# EasyEDA Pro project stm32-motordrive.epro, board PCB3
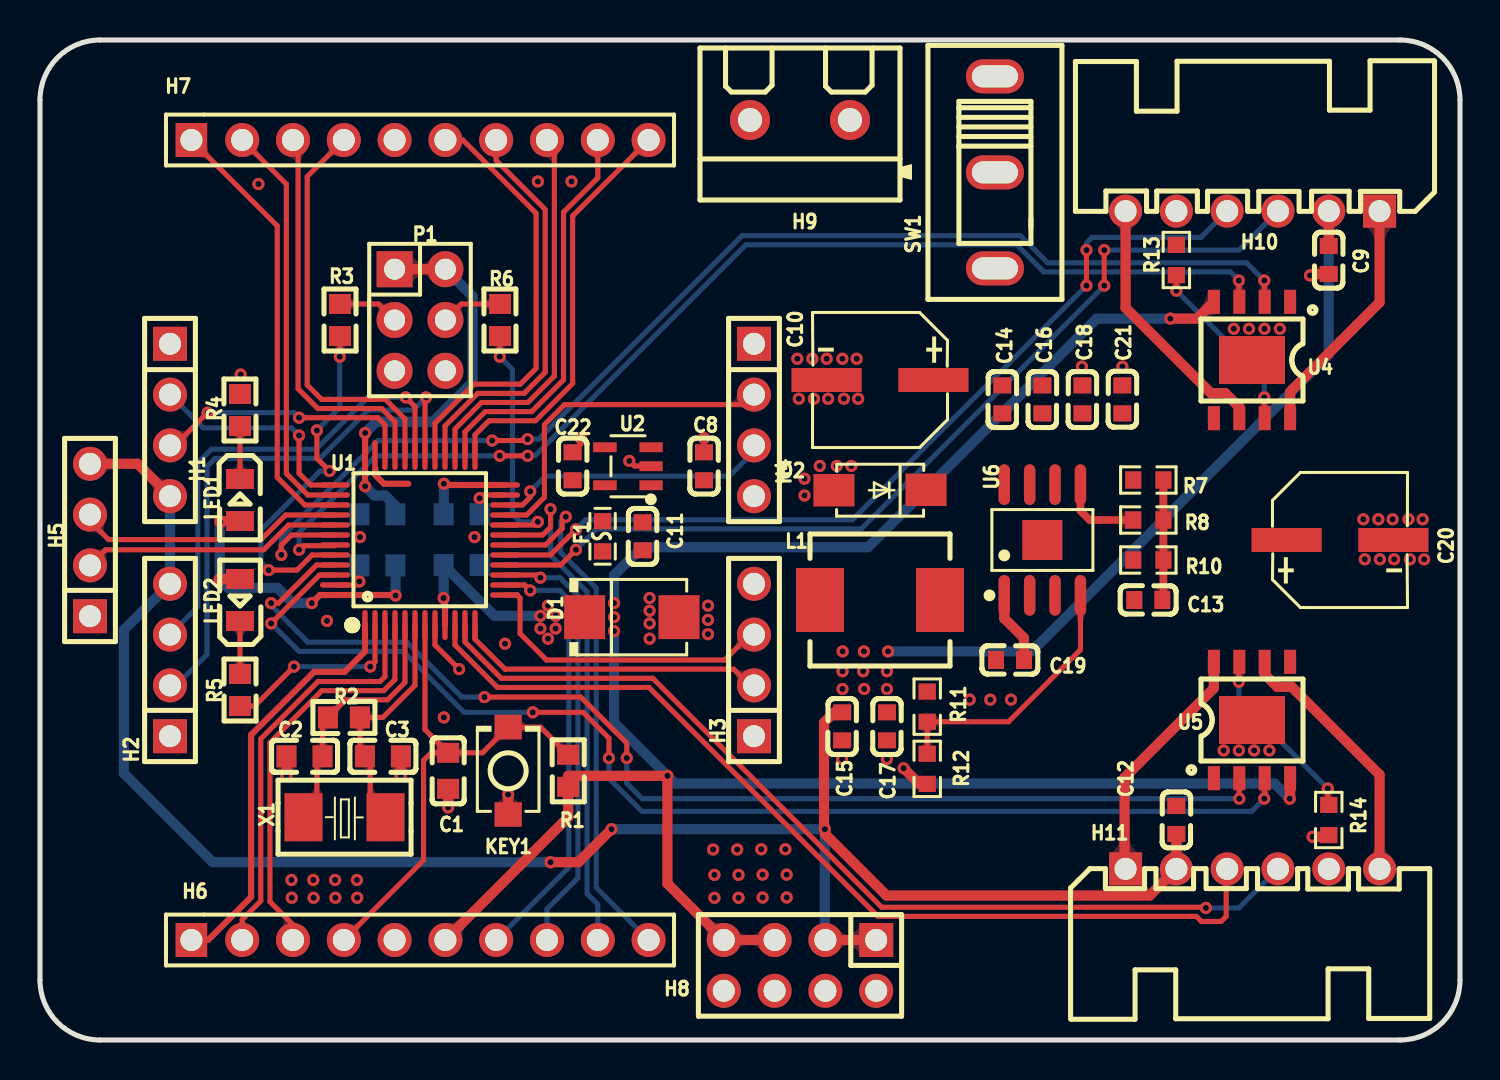
[diagram p9: board, top side]
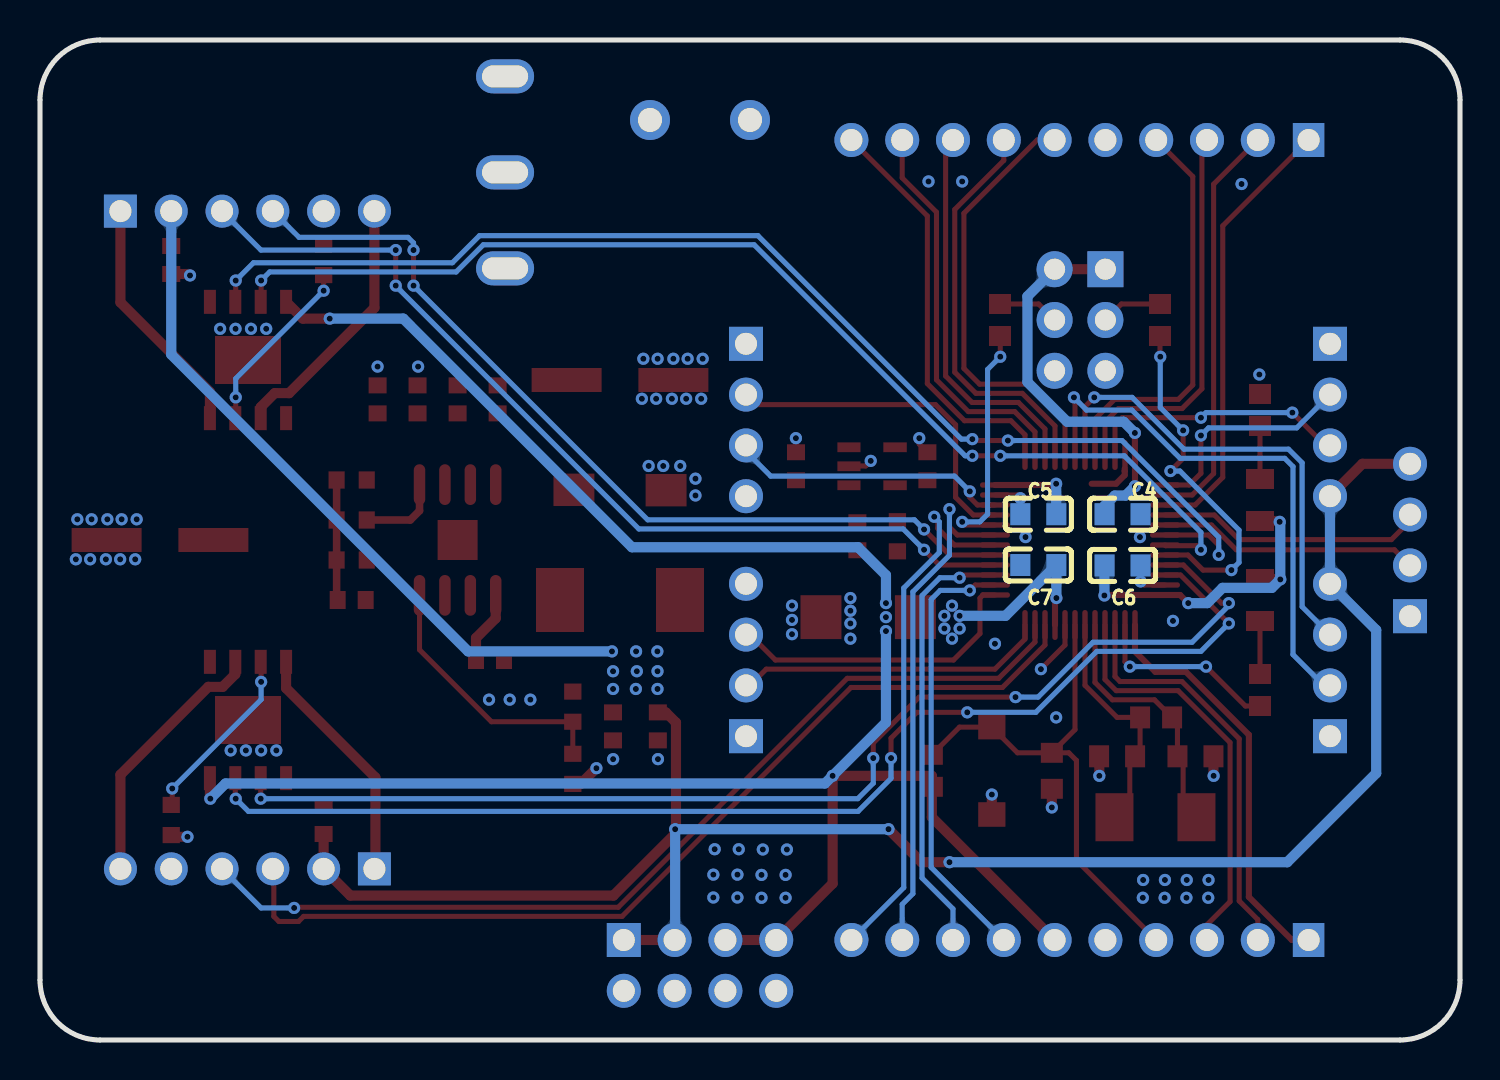
[diagram p10: board, bottom side, seen from below]

Outline 71 x 50 mm; copper layers: Top Layer, Bottom Layer. Coordinates in mm from the lower left corner of the outline.
Outline path: 0,47 0,3 arc(0.88,0.88) 3,0 68,0 arc(70.12,0.88) 71,3 71,47 arc(70.12,49.12) 68,50 3,50 arc(0.88,49.12) 0,47
Stack: Top Layer 0.035mm / Dielectric1 1.51mm FR4 er 4.5 / Bottom Layer 0.035mm

## Design rules (mm)
template: 自定义配置
spacing copperThickness1oz (default): track to track 0.203, other pairs 0.203 to 0.203
spacing copperThickness2oz: track to track 0.203, other pairs 0.152 to 0.3
track width copperThickness1oz (default): min 0.254, default 0.254, max 0.762
track width VCC &amp; GND: min 0.254, default 0.508, max 0.762
differential pair differentialPair (default): width min 0.127, default 0.254, max 2.54; gap min 0.152, default 0.152
via viaSize (default): diameter min 0.5, default 0.61, max 10; hole min 0.3, default 0.305, max 6.299
net GND uses VCC &amp; GND
net 3V3 uses VCC &amp; GND
net VIN uses VCC &amp; GND
net 5V uses VCC &amp; GND
net VBAT uses VCC &amp; GND
net VIN_SW uses VCC &amp; GND

## Placement (name value [footprint] x y rotation side)
C1  104  [C0603]  20.41 13.46 270 top
C2  22P  [C0603]  13.23 14.19 0 top
C3  22P  [C0603]  17.14 14.19 180 top
C4  104  [C0603]  16.87 26.29 180 bottom
C5  104  [C0603]  21.08 26.29 0 bottom
C6  104  [C0603]  16.87 23.73 180 bottom
C7  104  [C0603]  21.08 23.75 0 bottom
C8  1uF  [C0603#2]  33.2 28.69 270 top
C9  0.1uF  [C0603#2]  64.44 39 90 top
C10  220uF 25V  [CAP-SMD_BD6.3-L6.6-W6.6-LS7.2-FD]  42 33 180 top
C11  1uF  [C0603#2]  30.13 25.19 90 top
C12  0.1uF  [C0603#2]  56.82 11 270 top
C13  100nF  [C0603#2]  55.42 22 0 top
C14  47uF  [C0603#2]  48.12 32.03 90 top
C15  22nF  [C0603#2]  40.11 15.68 90 top
C16  22uF  [C0603#2]  50.12 32.03 90 top
C17  4.7uF  [C0603#2]  42.35 15.68 90 top
C18  4.7uF  [C0603#2]  52.12 32.03 90 top
C19  10nF  [C0603#2]  48.5 19 0 top
C20  220uF 25V  [CAP-SMD_BD6.3-L6.6-W6.6-LS7.2-FD]  65 25 0 top
C21  0.1uF  [C0603#2]  54.12 32.03 270 top
C22  0.1uF  [C0603#2]  26.63 28.69 270 top
D1  SMBJ3.3A  [SMB_L4.6-W3.6-LS5.3-RD]  29.59 21.14 0 top
D2  SS54  [SMA_L4.3-W2.6-LS5.0-FD]  42 27.5 0 top
F1  BSMD0603-050-6V  [F0603]  28.13 25.19 270 top
H1  PZ254V-11-04P  [HDR-TH_4P-P2.54-V-M]  6.5 31 270 top
H2  PZ254V-11-04P  [HDR-TH_4P-P2.54-V-M]  6.5 19 90 top
H3  PZ254V-11-04P  [HDR-TH_4P-P2.54-V-M]  35.7 19 90 top
H4  PZ254V-11-04P  [HDR-TH_4P-P2.54-V-M]  35.7 31 270 top
H5  PZ254V-11-04P  [HDR-TH_4P-P2.54-V-M]  2.5 25 90 top
H6  2.54-1*10P针  [HDR-TH_10P-P2.54-V-M-1]  19 5 0 top
H7  2.54-1*10P针  [HDR-TH_10P-P2.54-V-M-1]  19 45 0 top
H8  PZ2.54-2*4  [HDR-TH_8P-P2.54-V-M-R2-C4-S2.54]  38 3.73 180 top
H9  XY301V-A-5.0-2P  [CONN-TH_XY301V-A-5.0-2P]  38 46 0 top
H10  -  [XH2.54-LI-6P弯针]  62 45 270 top
H11  -  [XH2.54-LI-6P弯针]  59.26 5 90 top
KEY1  TS-1088-AR02016  [SW-SMD_L3.9-W3.0-P4.45]  23.41 13.46 90 top
L1  6.8uH  [IND-SMD_L7.0-W6.6]  42 22 0 top
LED1  NCD0805R1  [LED0805-R-RD]  10 27 270 top
LED2  NCD0805R1  [LED0805-R-RD]  10 22 90 top
P1  2.54-2*3P针  [HDR-TH_6P-P2.54-V-M-R2-C3-S2.54-1]  19 36 270 top
R1  10k  [R0603]  26.41 13.46 90 top
R2  1M  [R0603]  15.2 16.13 0 top
R3  10k  [R0603]  15 36 90 top
R4  510R  [R0603]  10 31.5 270 top
R5  510R  [R0603]  10 17.5 90 top
R6  10k  [R0603]  23 36 270 top
R7  10K(%0.1)  [R0603#2]  55.42 28 180 top
R8  0  [R0603#2]  55.42 26 180 top
R10  6.8kNTC  [R0603#2]  55.42 24 0 top
R11  10K(%0.1)  [R0603#2]  44.36 16.67 90 top
R12  3.3K  [R0603#2]  44.36 13.56 90 top
R13  R250  [R0603#2]  56.82 39 90 top
R14  R250  [R0603#2]  64.44 11 270 top
SW1  -  [SW-TH_SHOU-HAN_SS12D10G4]  48 43 270 top
U1  STM32F103C8T6  [LQFP-48_L7.0-W7.0-P0.50-LS9.0-BL]  19 25 0 top
U2  RT9013-33GB  [SOT-23-5_L3.0-W1.7-P0.95-LS2.8-BL]  29.4 28.69 90 top
U4  AT8236  [ESOP-8_L4.9-W3.9-P1.27-LS6.0-BL-EP]  60.6 34 180 top
U5  AT8236  [ESOP-8_L4.9-W3.9-P1.27-LS6.0-BL-EP]  60.6 16 0 top
U6  RT8289GSP  [SOIC-8_L5.0-W4.0-P1.27-LS6.0-BL-EP2.0]  50.12 25 0 top
X1  8MHz  [CRYSTAL-SMD_L5.0-W3.2]  15.23 11.14 0 top

## Footprints (pads in the part's own frame, mm; a bottom-side part is the same pattern mirrored in y, then rotated)
C0603
  rect 1x1.1 smd: 1(0.9,0) 2(-0.9,0)
C0603#2
  rect 0.8x0.9 smd: 1(-0.7,0) 2(0.7,0)
CAP-SMD_BD6.3-L6.6-W6.6-LS7.2-FD
  rect 3.5x1.2 smd: 1(-2.67,0) 2(2.67,0)
CONN-TH_XY301V-A-5.0-2P
  round 2 hole 1.2: 1(-2.5,0) 2(2.5,0)
CRYSTAL-SMD_L5.0-W3.2
  rect 1.9x2.4 smd: 1(-2.05,0) 2(2.05,0)
ESOP-8_L4.9-W3.9-P1.27-LS6.0-BL-EP
  rect 0.6x1.2 smd: 1(-1.905,-2.909) 2(-0.635,-2.909) 3(0.635,-2.909) 4(1.905,-2.909) 5(1.905,2.909) 6(0.635,2.909) 7(-0.635,2.909) 8(-1.905,2.909)
  rect 3.3x2.4 smd: 9(0,0)
F0603
  rect 0.806x0.864 smd: 1(-0.753,0) 2(0.753,0)
HDR-TH_4P-P2.54-V-M
  rect 1.7x1.7 hole 1.1: 1(-3.81,0)
  round 1.7 hole 1.1: 2(-1.27,0) 3(1.27,0) 4(3.81,0)
HDR-TH_6P-P2.54-V-M-R2-C3-S2.54-1
  rect 1.8x1.8 hole 1.05: 1(-2.54,-1.27)
  round 1.8 hole 1.05: 2(-2.54,1.27) 3(0,-1.27) 4(0,1.27) 5(2.54,-1.27) 6(2.54,1.27)
HDR-TH_8P-P2.54-V-M-R2-C4-S2.54
  rect 1.7x1.7 hole 1.1: 1(-3.81,-1.27)
  round 1.7 hole 1.1: 2(-3.81,1.27) 3(-1.27,-1.27) 4(-1.27,1.27) 5(1.27,-1.27) 6(1.27,1.27) 7(3.81,-1.27) 8(3.81,1.27)
HDR-TH_10P-P2.54-V-M-1
  rect 1.575x1.7 hole 1.1: 1(-11.43,0)
  round 1.7 hole 1.1: 2(-8.89,0) 3(-6.35,0) 4(-3.81,0) 5(-1.27,0) 6(1.27,0) 7(3.81,0) 8(6.35,0) 9(8.89,0) 10(11.43,0)
IND-SMD_L7.0-W6.6
  rect 2.4x3.2 smd: 1(-3,0) 2(3,0)
LED0805-R-RD
  rect 1x1.399 smd: 1(1.05,0) 2(-1.05,0)
LQFP-48_L7.0-W7.0-P0.50-LS9.0-BL
  oval 0.27x1.5 smd: 1(-2.75,-4.25) 2(-2.25,-4.25) 3(-1.75,-4.25) 4(-1.25,-4.25) 5(-0.75,-4.25) 6(-0.25,-4.25) 7(0.25,-4.25) 8(0.75,-4.25) 9(1.25,-4.25) 10(1.75,-4.25) 11(2.25,-4.25) 12(2.75,-4.25) 25(2.75,4.25) 26(2.25,4.25) 27(1.75,4.25) 28(1.25,4.25) 29(0.75,4.25) 30(0.25,4.25) 31(-0.25,4.25) 32(-0.75,4.25) 33(-1.25,4.25) 34(-1.75,4.25) 35(-2.25,4.25) 36(-2.75,4.25)
  oval 1.5x0.27 smd: 13(4.25,-2.75) 14(4.25,-2.25) 15(4.25,-1.75) 16(4.25,-1.25) 17(4.25,-0.75) 18(4.25,-0.25) 19(4.25,0.25) 20(4.25,0.75) 21(4.25,1.25) 22(4.25,1.75) 23(4.25,2.25) 24(4.25,2.75) 37(-4.25,2.75) 38(-4.25,2.25) 39(-4.25,1.75) 40(-4.25,1.25) 41(-4.25,0.75) 42(-4.25,0.25) 43(-4.25,-0.25) 44(-4.25,-0.75) 45(-4.25,-1.25) 46(-4.25,-1.75) 47(-4.25,-2.25) 48(-4.25,-2.75)
R0603
  rect 1x1.1 smd: 1(0.8,0) 2(-0.8,0)
R0603#2
  rect 0.806x0.864 smd: 1(-0.753,0) 2(0.753,0)
SMA_L4.3-W2.6-LS5.0-FD
  rect 2.046x1.62 smd: 1(-2.304,-0.009) 2(2.304,0.009)
SMB_L4.6-W3.6-LS5.3-RD
  rect 2.047x2.192 smd: 1(-2.361,0) 2(2.361,0)
SOIC-8_L5.0-W4.0-P1.27-LS6.0-BL-EP2.0
  oval 0.574x2.038 smd: 1(-1.905,-2.769) 2(-0.635,-2.769) 3(0.635,-2.769) 4(1.905,-2.769) 5(1.905,2.769) 6(0.635,2.769) 7(-0.635,2.769) 8(-1.905,2.769)
  rect 2x2 smd: 9(0,0)
SOT-23-5_L3.0-W1.7-P0.95-LS2.8-BL
  rect 0.49x1.157 smd: 1(-0.95,-1.153) 2(0,-1.153) 3(0.95,-1.153)
  rect 0.49x1.175 smd: 4(0.95,1.153) 5(-0.95,1.153)
SW-SMD_L3.9-W3.0-P4.45
  rect 1.23x1.36 smd: 1(-2.185,0) 2(2.185,0)
SW-TH_SHOU-HAN_SS12D10G4
  oval 1.7x2.9 hole 1.1x2.3: 1(-5.181,-0.254) 2(-0.381,-0.254) 3(4.419,-0.254)
XH2.54-LI-6P弯针
  rect 1.65x1.65 hole 1.1: 1(3.556,4.979)
  round 1.65 hole 1.1: 2(3.556,2.438) 3(3.556,-0.102) 4(3.556,-2.642) 5(3.556,-5.181) 6(3.556,-7.721)

## Nets
As in the schematic.

Pads without a net: SW1 1; U2 4; U6 2 3

## Via types
v1: diameter 0.61, hole 0.305, Top Layer to Bottom Layer, 166 vias

## Routing (per net, layer and track width the routed paths; a pad name or vN(x,y) marks a point on that pad's centre or on a via; arc(x,y) is an arc through that point)
3V3: length 155.2
  Top Layer w0.305: v1(16.26,27.69) 16.25,27.69 U1.36 16.26,29.26 v1(16.26,30.35) ; U1.24 20.26,27.75 v1(20.19,27.81) ; v1(20.18,22.1) 20.25,22.03 U1.9 ; v1(13.59,21.84) 14,22.25 U1.48 17.75,22.25 v1(17.78,22.22)
  Top Layer w0.508: v1(9.02,25.91) 9.06,25.95 LED1.1 ; U4.4 57.85,36.07 v1(56.51,36.07) ; v1(8.99,23.03) 9.01,23.05 LED2.1 ; H8.5 H8.7 31.37,7.82 v1(31.37,13.21) 26.42,13.21 26.41,13.2 R1.2 26.41,11.14 H6.6 ; U5.4 62.5,12.09 v1(62.48,12.06) ; P1.1 P1.2
  Bottom Layer w0.508: C5.2 20.19,26.3 v1(20.19,27.81) ; v1(16.26,27.69) 16.72,27.22 17.26,27.22 17.77,26.71 C4.2 ; v1(56.51,36.07) 52.83,36.07 41.4,24.64 30.1,24.64 28.7,23.24 v1(28.7,21.84) ; v1(28.7,20.45) 28.7,15.88 v1(31.37,13.21) 31.75,12.83 61.72,12.83 v1(62.48,12.06) ; v1(9.02,25.91) 8.99,25.88 v1(8.99,23.03) 9.41,22.61 11.87,22.61 12.64,21.84 v1(13.59,21.84) ; v1(25.02,21.21) 22.72,21.21 C7.2 v1(20.18,22.1) ; v1(17.78,22.22) 17.78,23.72 C6.2 ; P1.2 21.63,37.18 21.63,32.9 19.64,30.91 16.81,30.91 v1(16.26,30.35)
  vias: v1(25.02,20.57) v1(25.4,21.72) v1(25.4,20.07) v1(25.78,21.21) v1(25.78,20.57) v1(28.7,21.14)
5V: length 130.1
  Top Layer w0.508: H5.4 4.88,28.81 H1.4 ; H8.3 H8.1 ; C15.2 39.71,16.38 39.2,15.87 39.2,10.58 v1(39.24,10.54) 39.24,10.31 42.33,7.22 55.48,7.22 H11.2 56.82,10.35 ; v1(25.53,8.89) 26.92,8.89 v1(28.57,10.54) ; C9.2 H10.2
  Bottom Layer w0.508: v1(28.57,10.54) v1(39.24,10.54) 39.24,5.03 H8.3 ; H1.4 H2.4 4.19,20.5 4.19,13.33 8.64,8.89 v1(25.53,8.89) ; H10.2 64.44,34.28 49.59,19.43 v1(42.4,19.43)
  vias: v1(40.13,19.43) v1(40.13,18.44) v1(40.13,17.55) v1(41.2,19.43) v1(41.16,18.44) v1(41.21,17.55) v1(42.35,18.44) v1(42.35,17.55)
GND: length 17.5
  Top Layer w0.254: U1.8 19.75,19.75 v1(20.96,18.54) ; C8.1 33.2,30.09 v1(33.21,30.09) ; v1(15.97,22.93) 15.79,22.75 U1.47 ; v1(21.98,27.09) 22.14,27.25 U1.23 ; v1(29.46,28.96) 29.72,28.7 30.54,28.7 U2.2 ; v1(27.04,30.09) 27.04,29.79 C22.1
  Top Layer w0.305: 16.76,28.45 16.76,28.57 ; 16.76,28.45 16.76,28.24 17.2,27.81 18.41,27.81 ; 16.76,28.45 16.76,28.44
  Top Layer w0.508: C1.1 v1(20.41,11.63) ; v1(43.18,13.59) 43.97,12.8 R12.1 ; C3.2 18.03,14.17 v1(18.03,13.21) ; v1(63.63,10.16) 64.35,10.16 R14.2 ; v1(12.32,13.21) 12.33,13.22 C2.2 ; C9.1 63.57,38.3 v1(63.5,38.23) ; 23.41,11.28 v1(23.41,12.27)
  vias: v1(10.03,33.27) v1(10.92,42.8) v1(12.57,8) v1(12.59,7.11) v1(13.66,8) v1(13.68,7.11) v1(14.35,20.95) v1(14.75,8) v1(14.77,7.11) v1(15.84,8) v1(15.86,7.11) v1(16,25.15) v1(20.19,16.13) v1(21.72,25.15) v1(23.25,19.81) v1(24.89,42.93) v1(26.57,42.93) v1(30.48,22.1) v1(30.48,21.46) v1(30.48,20.83) v1(30.48,20.07) v1(33.4,21.72) v1(33.4,21) v1(33.4,20.29) v1(33.66,9.53) v1(33.72,8.25) v1(33.72,7.11) v1(34.86,9.53) v1(34.93,8.25) v1(34.93,7.11) v1(36.06,9.54) v1(36.13,8.27) v1(36.13,7.13) v1(37.27,9.54) v1(37.33,8.27) v1(37.33,7.13) v1(37.87,34.06) v1(37.94,32.06) v1(38.23,28.07) v1(38.23,27.23) v1(38.62,34.06) v1(38.69,32.06) v1(38.99,28.7) v1(39.33,34.06) v1(39.41,32.06) v1(39.84,28.7) v1(40.12,34.06) v1(40.1,14.04) v1(40.19,32.06) v1(40.57,28.7) v1(40.83,34.06) v1(40.91,32.06) v1(42.34,14.04) v1(46.48,17.02) v1(47.51,17.02) v1(48.55,17.02) v1(52.1,33.67) v1(54.12,33.67) v1(59.18,14.48) v1(59.69,35.56) v1(59.94,14.48) v1(60.45,35.56) v1(60.71,14.48) v1(61.22,35.56) v1(61.47,14.48) v1(61.99,35.56) v1(66.17,26.03) v1(66.24,24.03) v1(66.92,26.03) v1(66.99,24.03) v1(67.63,26.03) v1(67.71,24.03) v1(68.42,26.03) v1(68.49,24.03) v1(69.13,26.03) v1(69.21,24.03)
VBAT: length 20.7
  Top Layer w0.305: U1.1 16.25,19.42 15.23,18.41 13.7,18.41 10.56,15.26 10.56,7.15 8.41,5 H6.1
AOUT1: length 12.2
  Top Layer w0.508: H10.1 66.98,36.88 62.5,32.41 U4.8
AOUT2: length 13.1
  Top Layer w0.508: U4.6 59.97,31.64 59.26,32.34 58.54,32.34 54.28,36.61 H10.6
BOOT0: length 17.8
  Top Layer w0.254: U1.44 13.6,24.25 12.85,23.5 v1(11.43,23.5) ; v1(14.48,28.45) 13.84,29.08 v1(13.84,30.48) ; R3.2 15,34.29
  Bottom Layer w0.254: v1(14.99,34.16) 14.99,31.62 v1(13.84,30.48) ; v1(14.48,28.45) 14,28.45 11.05,25.49 11.05,23.88 v1(11.43,23.5)
BOOT1: length 12.3
  Top Layer w0.254: v1(24.89,25.91) 24.73,25.75 U1.20 ; v1(22.99,34.16) 22.99,35.19 R6.1
  Bottom Layer w0.254: v1(24.89,25.91) 24,25.91 23.62,26.29 23.62,33.53 v1(22.99,34.16)
BOUT1: length 12.2
  Top Layer w0.508: U5.8 58.69,17.59 54.23,13.13 54.23,8.61 H11.1
BOUT2: length 13.2
  Top Layer w0.508: 61.24,18.91 61.24,18.29 61.87,17.66 62.58,17.66 66.98,13.26 H11.6
FB: length 13.5
  Top Layer w0.254: R12.2 R11.1 48.43,15.91 52.02,19.51 U6.4
OSCIN: length 12.9
  Top Layer w0.254: X1.1 13.84,11.81 13.84,13.9 C2.1 14.13,15.86 R2.2 15.28,17.01 17.38,17.01 18.25,17.88 U1.5
OSCOUT: length 12
  Top Layer w0.254: U1.6 18.75,17.73 17.14,16.13 R2.1 16,14.43 C3.1 16.51,13.92 16.51,11.91 X1.2
P_EN: length 6
  Top Layer w0.381: R7.1 R8.1 R10.2 56.17,22.05 C13.2
P_EN1: length 4.1
  Top Layer w0.381: 54.66,26 52.49,26 52.02,26.46 U6.5
PA0: length 47.8
  Top Layer w0.254: H11.3 59.31,8.51 59.31,6.18 59.06,5.93 58.07,5.93 57.82,6.18 41.9,6.18 30.45,17.63 22.87,17.63 20.75,19.75 U1.10
PA1: length 47.8
  Top Layer w0.254: v1(58.29,6.6) 58.26,6.64 42.09,6.64 30.64,18.08 23.06,18.08 21.25,19.9 U1.11
  Bottom Layer w0.254: H11.4 59.95,6.6 v1(58.29,6.6)
PA2: length 15.4
  Top Layer w0.254: 35.5,17.73 34.69,18.54 23.25,18.54 21.75,20.04 U1.12
PA3: length 15.2
  Top Layer w0.254: U1.13 23.85,22.25 24,22.1 24,20.32 25.32,19 34.23,19 35.5,20.27
PA4: length 22
  Top Layer w0.254: U1.14 24.24,22.75 v1(24.51,22.48)
  Bottom Layer w0.254: H6.7 26.44,8.63 26.44,22.03 25.99,22.48 v1(24.51,22.48)
PA5: length 21.9
  Top Layer w0.254: v1(25.02,23.11) 24.88,23.25 U1.15
  Bottom Layer w0.254: H6.8 25.35,6.55 26.9,8.1 26.9,22.22 26,23.11 v1(25.02,23.11)
PA6: length 47
  Top Layer w0.254: v1(53.21,39.5) v1(53.21,37.72) ; U1.16 26.04,23.75 v1(26.8,24.51)
  Bottom Layer w0.254: v1(53.21,37.72) 53.21,37.71 41.06,25.55 27.84,25.55 v1(26.8,24.51) ; v1(53.21,39.5) 59.95,39.5 H10.3
PA7: length 44.5
  Top Layer w0.254: U1.17 25.52,24.25 v1(26.8,25.53) ; v1(52.32,37.72) v1(52.32,39.5)
  Bottom Layer w0.254: v1(52.32,39.5) 52.32,39.86 52.6,40.13 58.05,40.13 H10.4 ; v1(26.8,25.53) 27.28,26.01 40.62,26.01 v1(52.32,37.72)
PA8: length 21.6
  Top Layer w0.254: U1.29 19.75,30.85 21.7,32.79 24.02,32.79 24.8,33.58 24.8,41.34 21.14,45 H7.6
PA9: length 27.2
  Top Layer w0.254: U1.30 19.25,32.08 v1(19.3,32.13)
  Bottom Layer w0.254: v1(19.3,32.13) 18.67,31.5 16.4,31.5 13.99,29.08 8.76,29.08 8.35,28.67 8.35,19.27 6.81,17.73 H2.2
PA10: length 24
  Top Layer w0.254: U1.31 18.75,31.67 v1(18.29,32.13)
  Bottom Layer w0.254: H2.3 7.89,21.66 7.89,28.86 8.57,29.54 13.8,29.54 16.39,32.13 v1(18.29,32.13)
PA11: length 20.4
  Top Layer w0.254: U1.32 18.25,31.05 17.27,32.03 14.08,32.03 13.36,32.75 13.36,43.17 H7.4
PA12: length 19.7
  Top Layer w0.254: U1.33 17.75,30.9 17.08,31.57 13.89,31.57 12.9,32.56 12.9,44.75 H7.3
PA13: length 13.2
  Top Layer w0.254: U1.34 17.25,30.76 16.89,31.11 v1(12.95,31.11) ; v1(8.38,31.37) 6.74,29.73 H1.3
  Bottom Layer w0.254: v1(8.38,31.37) 12.7,31.37 v1(12.95,31.11)
PA14: length 11.2
  Top Layer w0.254: v1(12.95,30.23) 12.95,28.33 13.54,27.75 U1.37
  Bottom Layer w0.254: H1.2 8.16,30.61 12.57,30.61 v1(12.95,30.23)
PA15: length 20.5
  Top Layer w0.254: H7.2 12.32,42.79 12.32,28.32 13.39,27.25 U1.38
PB0: length 26.9
  Top Layer w0.254: U1.18 25.28,24.75 26.11,25.58 26.11,25.98 v1(26.29,26.16)
  Bottom Layer w0.254: v1(26.29,26.16) 26.03,25.91 26.03,24.37 27.81,22.6 27.81,7.62 H6.10
PB1: length 25.9
  Top Layer w0.254: v1(25.53,26.54) 25.53,25.64 25.13,25.25 U1.19
  Bottom Layer w0.254: H6.9 27.89,6.78 27.36,7.32 27.36,22.41 25.53,24.24 v1(25.53,26.54)
PB3: length 22.1
  Top Layer w0.254: U1.39 13.24,26.75 11.86,28.13 11.86,40.71 H7.1
PB4: length 13.5
  Top Layer w0.254: H5.3 2.5,25.95 3.43,25.02 11.05,25.02 12.28,26.25 U1.40
PB5: length 13.1
  Top Layer w0.254: U1.41 12.43,25.75 11.19,24.51 3.28,24.51 H5.2
PB6: length 61.7
  Top Layer w0.254: v1(61.21,37.97) 61.21,36.93 61.24,36.91 ; v1(12.06,24.26) 12.06,24.74 12.57,25.25 U1.42 ; v1(22.61,29.97) 24.31,29.97 v1(24.38,30.04)
  Bottom Layer w0.254: v1(24.38,30.04) 24.93,30.04 35.1,40.22 49.02,40.22 50.38,38.86 60.32,38.86 v1(61.21,37.97) ; v1(12.06,24.26) 12.06,25.14 16.9,29.97 v1(22.61,29.97)
PB7: length 57.5
  Top Layer w0.254: U4.3 59.94,36.93 v1(59.94,37.97) ; U1.43 14.72,24.72 13.16,24.72 v1(12.95,24.51) ; v1(22.99,29.21) v1(24.38,29.21)
  Bottom Layer w0.254: v1(24.38,29.21) 24.74,29.21 35.29,39.76 48.84,39.76 50.19,38.4 59.51,38.4 v1(59.94,37.97) ; v1(22.99,29.21) 16.78,29.21 12.95,25.38 v1(12.95,24.51)
PB8: length 58.7
  Top Layer w0.254: v1(29.34,14.1) 29.34,14.85 27.04,17.14 v1(22.22,17.14) ; U1.45 13.83,23.75 11.92,21.84 v1(11.56,21.84) ; U5.2 v1(59.97,12.06)
  Bottom Layer w0.254: v1(59.97,12.06) 30.11,12.06 29.34,12.84 v1(29.34,14.1) ; v1(22.22,17.14) 21.09,17.14 18.35,19.89 13.39,19.89 11.56,21.73 v1(11.56,21.84)
PB9: length 60.2
  Top Layer w0.254: 11.56,20.83 13.98,23.25 U1.46 ; 61.24,13.09 61.24,12.09 v1(61.21,12.06) ; v1(28.45,14.1) 28.45,15.09 27.16,16.38 v1(24.64,16.38)
  Bottom Layer w0.254: v1(28.45,14.1) 28.45,13.08 30.1,11.43 60.58,11.43 v1(61.21,12.06) ; v1(11.56,20.83) 12.95,19.43 18.16,19.43 21.21,16.38 v1(24.64,16.38)
PB10: length 16.7
  Top Layer w0.254: 35.5,31.77 26.23,31.77 25.22,30.76 25.22,27.13 24.34,26.25 U1.21
PB11: length 13.5
  Top Layer w0.254: v1(24.51,27.43) 24.51,27.13 24.13,26.75 U1.22
  Bottom Layer w0.254: v1(24.51,27.43) 25.27,28.19 34.46,28.19 35.5,29.23
PB12: length 20.7
  Top Layer w0.254: H7.10 26.63,41.2 26.63,32.82 24.77,30.96 22.45,30.96 21.75,30.26 U1.25
PB13: length 19.9
  Top Layer w0.254: U1.26 21.25,30.41 22.26,31.42 24.59,31.42 26.18,33.01 26.18,41.39 27.89,43.11 H7.9
PB14: length 19.3
  Top Layer w0.254: U1.27 20.75,30.55 22.07,31.88 24.4,31.88 25.72,33.2 25.72,44.63 H7.8
PB15: length 20.2
  Top Layer w0.254: U1.28 20.25,30.7 21.89,32.33 24.21,32.33 25.26,33.39 25.26,41.53 22.81,43.98 H7.7
PC13: length 9.5
  Top Layer w0.254: v1(16.51,18.67) 16.75,18.91 U1.2 ; v1(12.7,18.67) 10.73,16.7 R5.2
  Bottom Layer w0.254: v1(12.7,18.67) v1(16.51,18.67)
PC14: length 20.5
  Top Layer w0.254: U1.3 17.25,18.17 17,17.92 13.9,17.92 11.04,15.06 11.04,6.95 10.11,6.02 H6.2
PC15: length 20.6
  Top Layer w0.254: H6.3 12.65,5.77 11.5,6.92 11.5,14.87 14.09,17.47 17.19,17.47 17.75,18.03 U1.4
RESET: length 26
  Top Layer w0.254: C1.2 22.12,14.36 KEY1.2 25.02,15.64 R1.1 ; C1.2 19.56,14.36 19.18,13.98 19.18,8.99 H6.4 ; C1.2 19.25,15.52 U1.7
$1N1502: length 3.1
  Top Layer w0.254: P1.3 16.93,36.8 R3.1
$1N1510: length 3.1
  Top Layer w0.254: R6.2 21.07,36.8 P1.4
$1N1523: length 2.6
  Top Layer w0.254: LED1.2 R4.1
$1N1525: length 2.6
  Top Layer w0.254: LED2.2 R5.1
$1N6534: length 3.6
  Top Layer w0.508: U6.1 48.21,21.08 49.2,20.1 C19.2
$1N6590: length 9
  Top Layer w0.254: R13.1 v1(56.82,37.47) ; v1(61.21,32.13) 61.21,31.11 61.24,31.09
  Bottom Layer w0.254: v1(61.21,32.13) 61.21,33.07 v1(56.82,37.47)
$1N26418: length 8.8
  Top Layer w0.254: 64.44,11.93 64.39,11.98 v1(64.39,12.57) ; v1(59.94,17.91) 59.94,18.89 U5.7
  Bottom Layer w0.254: v1(59.94,17.91) 59.94,17.02 v1(64.39,12.57)

## Copper pours and planes (outline as drawn; the poured copper is in the pictures)
3V3 on Top Layer: 27.69,24.89 28.83,24.89 29.08,24.64 29.08,19.97 28.83,19.72 25.32,19.72 24.76,20.27 24.76,21.6 27.69,24.2
3V3 on Bottom Layer: 24.64,22.1 26.03,22.1 26.03,19.81 24.64,19.81
3V3 on Bottom Layer: 17.02,27.18 20.91,27.18 20.91,22.77 17.02,22.77
3V3 on Bottom Layer: 28.32,22.42 28.32,19.99 29.08,19.99 29.08,22.42
5V on Top Layer: 29.97,30.1 31.88,30.1 32.27,29.71 32.27,28.69 33.46,28.69 34.09,28.07 35.83,28.07 40.91,23.42 42.19,21.05 45.21,18.03 45.21,16.89 43.85,16.89 42.71,15.75 39.2,15.75 39.2,18.77 36.38,21.59 34.54,21.59 33.78,22.35 33.78,25.65 32.05,27.39 29.98,27.39 29.98,28.03 30.15,28.19 31.4,28.19 31.4,29.06 31.37,29.08 30.1,29.08 29.97,29.21
5V on Bottom Layer: 39.5,20.19 43.06,20.19 43.06,16.76 39.5,16.76
GND on Top Layer: 0,50 71,50 71,0 0,0
GND on Bottom Layer: 0,50 71,50 71,0 0,0
VIN on Top Layer: 42.34,39.76 50.46,39.76 50.46,36.75 46.61,32.59 46.61,31.88 58.42,31.62 59.06,30.75 59.06,30.46 64.13,25.65 64.13,18.8 63.63,18.29 62.18,18.29 62.18,19.51 60.2,21.75 60.2,26.8 57.66,29.34 55.25,29.34 55.25,27.59 54.99,27.34 53.9,27.34 53.9,29.15 53.72,29.34 49.78,29.34 49.78,26.54 49.02,26.54 49.02,28.96 48.64,29.34 45.26,29.34 42,32.59 42,39.42
VIN_SW on Top Layer: 38.35,47.24 38.35,41.28 38.48,41.15 50.8,41.15 50.93,41.28 50.93,47.21 50.93,47.24
$1N6587 on Top Layer: 42.8,28.83 48.53,28.83 48.64,28.7 48.64,25.78 47.12,24.26 47.12,21.09 48.37,19.84 48.37,18.16 46.1,18.16 42.8,21.46
$1N71314 on Top Layer: 26,28.44 29.19,28.44 29.43,28.19 29.43,27.27 30.13,26.58 30.53,26.58 30.71,26.39 30.71,25.43 27.64,25.43 27.37,26.74 26.92,27.18 26.29,27.18 26,27.47

Small or netless copper shapes (teardrops, artwork), in the pictures only: 185 on Top Layer, 68 on Bottom Layer
